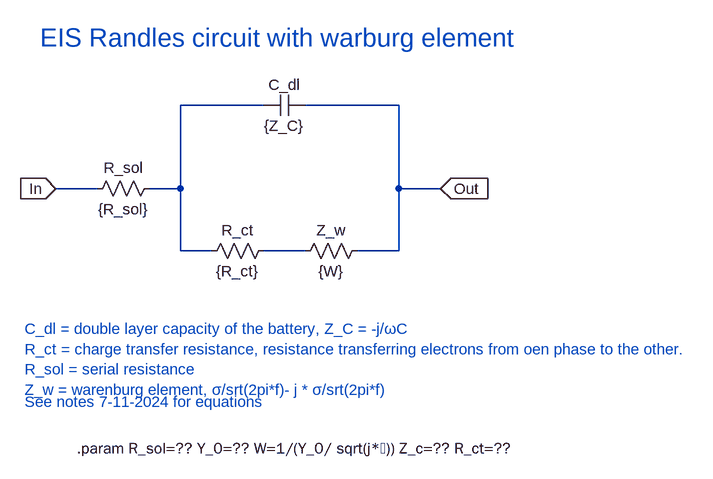
[diagram p0: schematic Walburg element.asc]
Walburg element.asc, the LTspice schematic file:
Version 4
SHEET 1 1376 680
WIRE 480 16 352 16
WIRE 688 16 544 16
WIRE 224 144 160 144
WIRE 352 144 352 16
WIRE 352 144 304 144
WIRE 688 144 688 16
WIRE 752 144 688 144
WIRE 352 240 352 144
WIRE 400 240 352 240
WIRE 544 240 480 240
WIRE 688 240 688 144
WIRE 688 240 624 240
FLAG 160 144 In
IOPIN 160 144 In
FLAG 752 144 Out
IOPIN 752 144 In
SYMBOL res 320 128 R90
WINDOW 0 0 56 VBottom 2
WINDOW 3 32 56 VTop 2
SYMATTR InstName R_sol
SYMATTR Value {R_sol}
SYMBOL res 496 224 R90
WINDOW 0 0 56 VBottom 2
WINDOW 3 32 56 VTop 2
SYMATTR InstName R_ct
SYMATTR Value {R_ct}
SYMBOL res 640 224 R90
WINDOW 0 0 56 VBottom 2
WINDOW 3 32 56 VTop 2
SYMATTR InstName Z_w
SYMATTR Value {W}
SYMBOL cap 544 0 R90
WINDOW 0 0 32 VBottom 2
WINDOW 3 32 32 VTop 2
SYMATTR InstName C_dl
SYMATTR Value {Z_C}
TEXT 112 360 Left 2 ;C_dl = double layer capacity of the battery, Z_C = -j/ωC\nR_ct = charge transfer resistance, resistance transferring electrons from oen phase to the other.\nR_sol = serial resistance\nZ_w = warenburg element, σ/srt(2pi*f)- j * σ/srt(2pi*f)
TEXT 136 -88 Left 4 ;EIS Randles circuit with warburg element
TEXT 112 472 Left 2 ;See notes 7-11-2024 for equations
TEXT 192 544 Left 2 !.param R_sol=?? Y_0=?? W=1/(Y_0/ sqrt(j*ꙍ)) Z_c=?? R_ct=??

The netlist it stands for:
* Walburg element.asc
R_sol N001 In {R_sol}
R_ct N002 N001 {R_ct}
R§Z_w Out N002 {W}
C_dl Out N001 {Z_C}
* C_dl = double layer capacity of the battery, Z_C = -j/ωC
* R_ct = charge transfer resistance, resistance transferring electrons from oen phase to the other.
* R_sol = serial resistance
* Z_w = warenburg element, σ/srt(2pi*f)- j * σ/srt(2pi*f)
* EIS Randles circuit with warburg element
* See notes 7-11-2024 for equations
.param R_sol=?? Y_0=?? W=1/(Y_0/ sqrt(j*ꙍ)) Z_c=?? R_ct=??
.backanno
.end